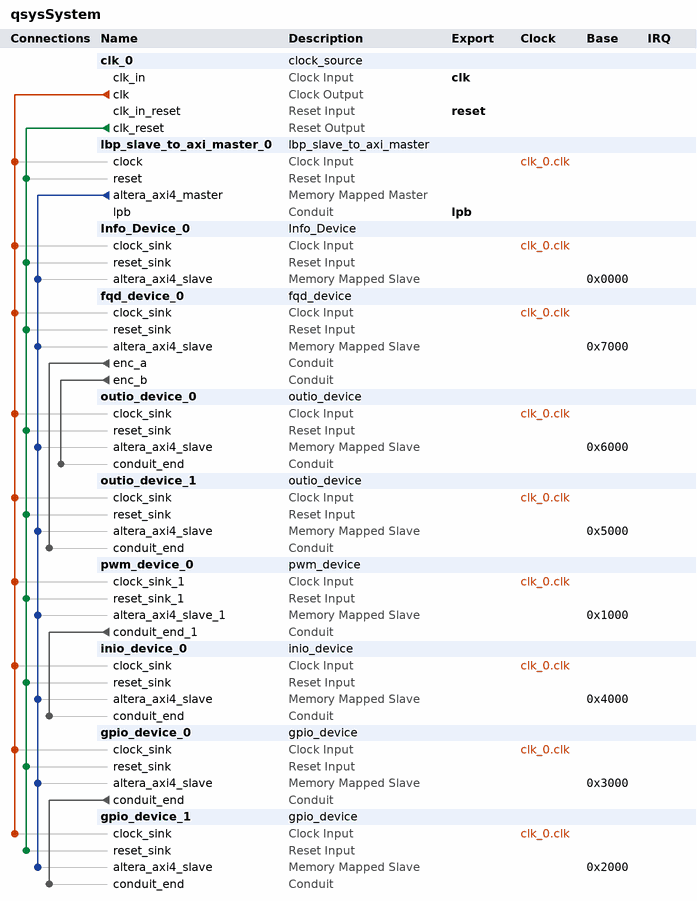
[diagram p0: system contents]
# Platform Designer (Qsys) system qsysSystem, Cyclone II EP2C8F256C8
# Parameters at their usual value, and those the tool derives, are not listed.
package require -exact qsys 13.0
create_system qsysSystem
set_project_property DEVICE_FAMILY {Cyclone II}
set_project_property DEVICE EP2C8F256C8

add_instance clk_0 clock_source 13.0
set_instance_parameter_value clk_0 clockFrequency 50000000

add_instance lbp_slave_to_axi_master_0 lbp_slave_to_axi_master 1.0
set_instance_parameter_value lbp_slave_to_axi_master_0 LPBADDRWIDTH 32
set_instance_parameter_value lbp_slave_to_axi_master_0 LPBDATAWIDTH 32
set_instance_parameter_value lbp_slave_to_axi_master_0 LPBTSIZEWIDTH 3
set_instance_parameter_value lbp_slave_to_axi_master_0 LPBCSWIDTH 2
set_instance_parameter_value lbp_slave_to_axi_master_0 LPBBANKWIDTH 2

add_instance Info_Device_0 Info_Device 1.0
set_instance_parameter_value Info_Device_0 unique_id 1
set_instance_parameter_value Info_Device_0 description 33477206241924123920969029910507941359207
set_instance_parameter_value Info_Device_0 dev_size 32768
set_instance_parameter_value Info_Device_0 C_S00_AXI_ID_WIDTH 1
set_instance_parameter_value Info_Device_0 C_S00_AXI_DATA_WIDTH 32
set_instance_parameter_value Info_Device_0 C_S00_AXI_ADDR_WIDTH 12

add_instance fqd_device_0 fqd_device 1.0
set_instance_parameter_value fqd_device_0 unique_id 4
set_instance_parameter_value fqd_device_0 number_of_fqds 4
set_instance_parameter_value fqd_device_0 C_S00_AXI_ID_WIDTH 1
set_instance_parameter_value fqd_device_0 C_S00_AXI_DATA_WIDTH 32
set_instance_parameter_value fqd_device_0 C_S00_AXI_ADDR_WIDTH 12

add_instance outio_device_0 outio_device 1.0
set_instance_parameter_value outio_device_0 number_of_gpios 4
set_instance_parameter_value outio_device_0 unique_id 2
set_instance_parameter_value outio_device_0 C_S00_AXI_ID_WIDTH 1
set_instance_parameter_value outio_device_0 C_S00_AXI_DATA_WIDTH 32
set_instance_parameter_value outio_device_0 C_S00_AXI_ADDR_WIDTH 12

add_instance outio_device_1 outio_device 1.0
set_instance_parameter_value outio_device_1 number_of_gpios 4
set_instance_parameter_value outio_device_1 unique_id 3
set_instance_parameter_value outio_device_1 C_S00_AXI_ID_WIDTH 1
set_instance_parameter_value outio_device_1 C_S00_AXI_DATA_WIDTH 32
set_instance_parameter_value outio_device_1 C_S00_AXI_ADDR_WIDTH 12

add_instance pwm_device_0 pwm_device 1.0
set_instance_parameter_value pwm_device_0 unique_id 5
set_instance_parameter_value pwm_device_0 number_of_pwms 4
set_instance_parameter_value pwm_device_0 base_clk 33000000
set_instance_parameter_value pwm_device_0 C_S00_AXI_ID_WIDTH 1
set_instance_parameter_value pwm_device_0 C_S00_AXI_DATA_WIDTH 32
set_instance_parameter_value pwm_device_0 C_S00_AXI_ADDR_WIDTH 12

add_instance inio_device_0 inio_device 1.0
set_instance_parameter_value inio_device_0 number_of_gpios 4
set_instance_parameter_value inio_device_0 unique_id 6
set_instance_parameter_value inio_device_0 C_S00_AXI_ID_WIDTH 1
set_instance_parameter_value inio_device_0 C_S00_AXI_DATA_WIDTH 32
set_instance_parameter_value inio_device_0 C_S00_AXI_ADDR_WIDTH 12

add_instance gpio_device_0 gpio_device 1.0
set_instance_parameter_value gpio_device_0 number_of_gpios 128
set_instance_parameter_value gpio_device_0 unique_id 7
set_instance_parameter_value gpio_device_0 C_S00_AXI_ID_WIDTH 1
set_instance_parameter_value gpio_device_0 C_S00_AXI_DATA_WIDTH 32
set_instance_parameter_value gpio_device_0 C_S00_AXI_ADDR_WIDTH 12

add_instance gpio_device_1 gpio_device 1.0
set_instance_parameter_value gpio_device_1 number_of_gpios 128
set_instance_parameter_value gpio_device_1 unique_id 8
set_instance_parameter_value gpio_device_1 C_S00_AXI_ID_WIDTH 1
set_instance_parameter_value gpio_device_1 C_S00_AXI_DATA_WIDTH 32
set_instance_parameter_value gpio_device_1 C_S00_AXI_ADDR_WIDTH 12

# connections
add_connection clk_0.clk fqd_device_0.clock_sink clock
add_connection clk_0.clk gpio_device_0.clock_sink clock
add_connection clk_0.clk gpio_device_1.clock_sink clock
add_connection clk_0.clk Info_Device_0.clock_sink clock
add_connection clk_0.clk inio_device_0.clock_sink clock
add_connection clk_0.clk lbp_slave_to_axi_master_0.clock clock
add_connection clk_0.clk outio_device_0.clock_sink clock
add_connection clk_0.clk outio_device_1.clock_sink clock
add_connection clk_0.clk pwm_device_0.clock_sink_1 clock
add_connection clk_0.clk_reset fqd_device_0.reset_sink reset
add_connection clk_0.clk_reset gpio_device_0.reset_sink reset
add_connection clk_0.clk_reset gpio_device_1.reset_sink reset
add_connection clk_0.clk_reset Info_Device_0.reset_sink reset
add_connection clk_0.clk_reset inio_device_0.reset_sink reset
add_connection clk_0.clk_reset lbp_slave_to_axi_master_0.reset reset
add_connection clk_0.clk_reset outio_device_0.reset_sink reset
add_connection clk_0.clk_reset outio_device_1.reset_sink reset
add_connection clk_0.clk_reset pwm_device_0.reset_sink_1 reset
add_connection lbp_slave_to_axi_master_0.altera_axi4_master fqd_device_0.altera_axi4_slave avalon
set_connection_parameter_value lbp_slave_to_axi_master_0.altera_axi4_master/fqd_device_0.altera_axi4_slave baseAddress 0x7000
add_connection lbp_slave_to_axi_master_0.altera_axi4_master gpio_device_0.altera_axi4_slave avalon
set_connection_parameter_value lbp_slave_to_axi_master_0.altera_axi4_master/gpio_device_0.altera_axi4_slave baseAddress 0x3000
add_connection lbp_slave_to_axi_master_0.altera_axi4_master gpio_device_1.altera_axi4_slave avalon
set_connection_parameter_value lbp_slave_to_axi_master_0.altera_axi4_master/gpio_device_1.altera_axi4_slave baseAddress 0x2000
add_connection lbp_slave_to_axi_master_0.altera_axi4_master Info_Device_0.altera_axi4_slave avalon
set_connection_parameter_value lbp_slave_to_axi_master_0.altera_axi4_master/Info_Device_0.altera_axi4_slave baseAddress 0x0000
add_connection lbp_slave_to_axi_master_0.altera_axi4_master inio_device_0.altera_axi4_slave avalon
set_connection_parameter_value lbp_slave_to_axi_master_0.altera_axi4_master/inio_device_0.altera_axi4_slave baseAddress 0x4000
add_connection lbp_slave_to_axi_master_0.altera_axi4_master outio_device_0.altera_axi4_slave avalon
set_connection_parameter_value lbp_slave_to_axi_master_0.altera_axi4_master/outio_device_0.altera_axi4_slave baseAddress 0x6000
add_connection lbp_slave_to_axi_master_0.altera_axi4_master outio_device_1.altera_axi4_slave avalon
set_connection_parameter_value lbp_slave_to_axi_master_0.altera_axi4_master/outio_device_1.altera_axi4_slave baseAddress 0x5000
add_connection lbp_slave_to_axi_master_0.altera_axi4_master pwm_device_0.altera_axi4_slave_1 avalon
set_connection_parameter_value lbp_slave_to_axi_master_0.altera_axi4_master/pwm_device_0.altera_axi4_slave_1 baseAddress 0x1000
add_connection fqd_device_0.enc_a outio_device_1.conduit_end conduit
add_connection fqd_device_0.enc_b outio_device_0.conduit_end conduit
add_connection gpio_device_0.conduit_end gpio_device_1.conduit_end conduit
add_connection pwm_device_0.conduit_end_1 inio_device_0.conduit_end conduit

# exported interfaces
add_interface clk clock sink
set_interface_property clk EXPORT_OF clk_0.clk_in
add_interface reset reset sink
set_interface_property reset EXPORT_OF clk_0.clk_in_reset
add_interface lpb conduit end
set_interface_property lpb EXPORT_OF lbp_slave_to_axi_master_0.lpb

set_interconnect_requirement {$system} qsys_mm.clockCrossingAdapter HANDSHAKE
set_interconnect_requirement {$system} qsys_mm.maxAdditionalLatency 1

save_system qsysSystem.qsys
